# Altium schematic sheet HC06_Schem.SchDoc
size A; SheetNumber: 5; SheetTotal: 6
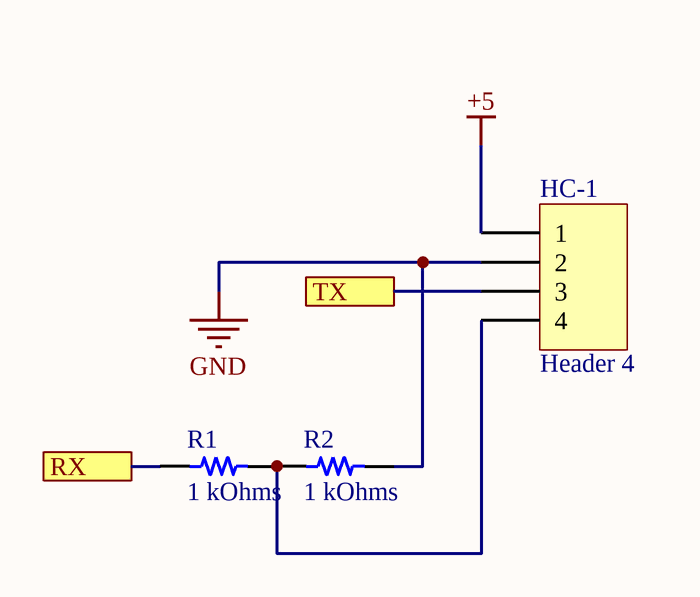
[diagram p0: HC06_Schem.SchDoc]

## Parts
HC-1  Header 4  [HDR1X4]
R1  1 kOhms  [RES 1210_3225]
R2  1 kOhms  [RES 1210_3225]

## Ports
RX, TX

## Nets
+5: HC-1.1
GND: HC-1.2 R2.2
RX: R1.1 ; port RX
TX: HC-1.3 ; port TX
NetHC-1_4: HC-1.4 R1.2 R2.1

## Library data of the parts
HC-1 = Header 4: Header, 4-Pin; LatestRevisionDate: 17-Jul-2002; LatestRevisionNote: Re-released for DXP Platform.; Publisher: Altium Limited
R1 R2 = ESR25JZPJ102: RES SMD 1K OHM 5% 2/3W 1210; Manufacturer: Rohm Semiconductor; Power (Watts): 0.667W, 2/3W; Temperature Coefficient: ±200ppm/°C; Part Number: ESR25JZPJ102; ComponentLink1Description: Datasheet; ComponentLink1URL: https://www.rohm.com/datasheet/ESR01MZPF/esr-e; ComponentLink2Description: DigiKey Link; ComponentLink2URL: https://www.digikey.com/en/products/detail/rohm-semiconductor/ESR25JZPJ102/2288498; Composition: Thick Film; Device Package: 1210 (3225 Metric); Features: Automotive AEC-Q200, Pulse Withstanding; Height - Seated (Max): 0.026" (0.65mm); LastUpdated: 9/19/2022 2:02:25 PM; Lifecycle Status: Active; Minimum Order: 1; Number of Terminations: 2; Operating Temperature: -55°C ~ 155°C; Package / Case: 1210 (3225 Metric); Packaging: TapeAndReel; Part Status: Active; Price: 0.05; Ratings: AEC-Q200; Resistance: 1 kOhms; Series: ESR; Size / Dimension: 0.126" L x 0.098" W (3.20mm x 2.50mm); Supplier 1: DigiKey; Supplier Part Number 1: RHM1.0KAXCT-ND; Supplier Device Package: 1210; Tolerance: ±5%; Value: 1 kOhms